# EAGLE design Projek (EAGLE 6.6.0)
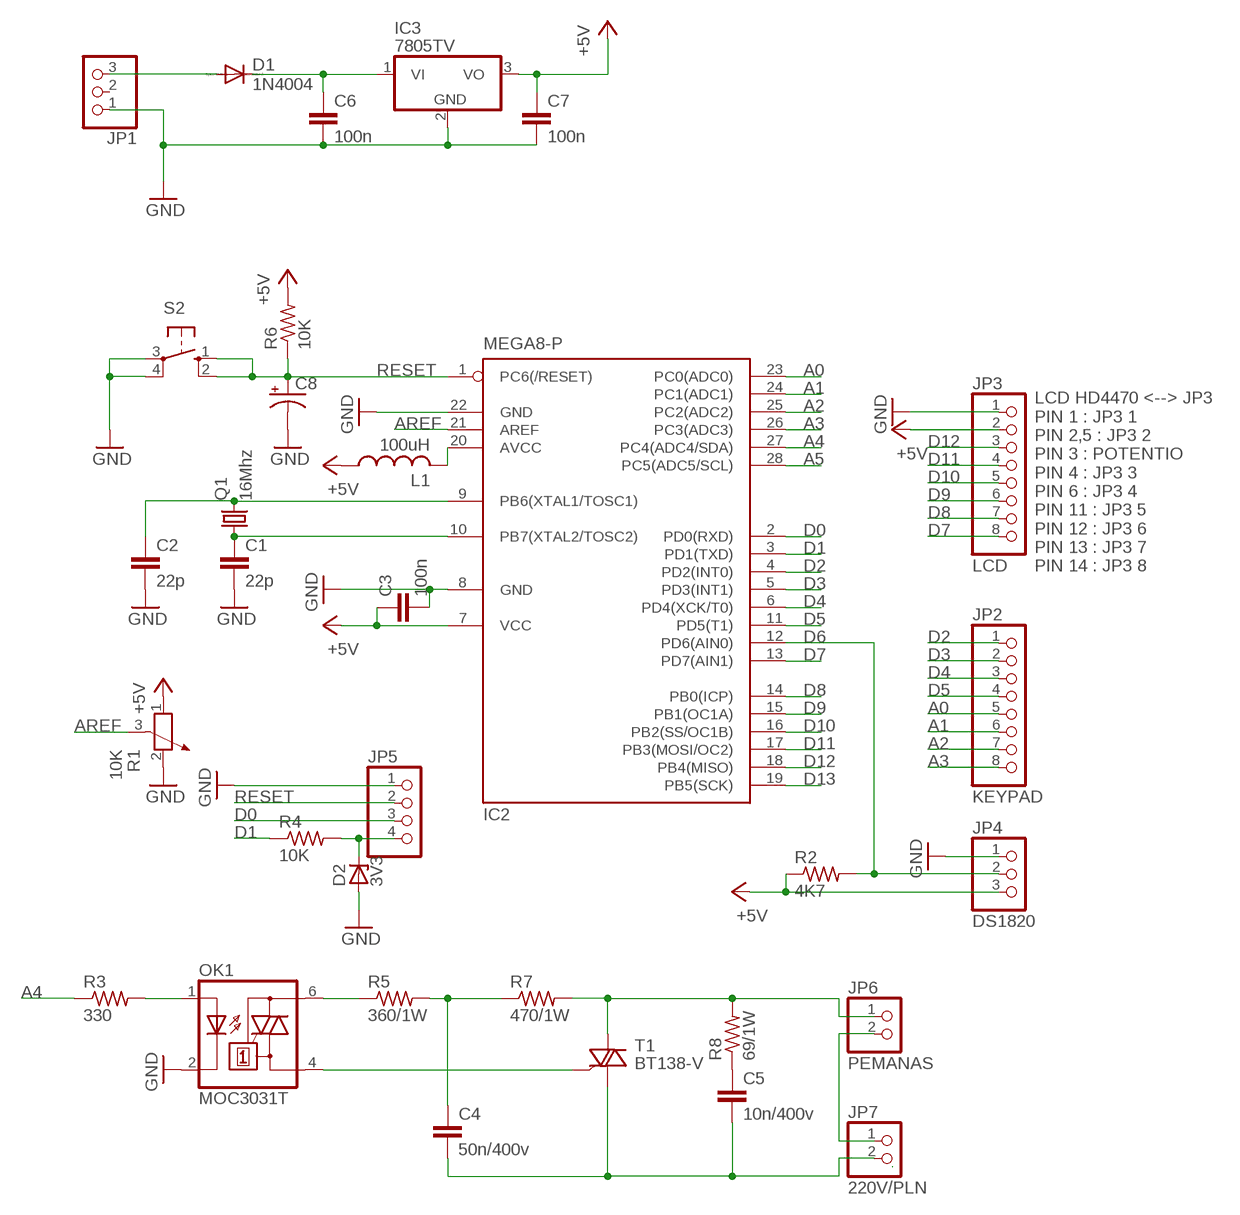
[diagram p0: schematic, sheet 1]

## Parts
C1  22p  C-EU025-025X050  [C025-025X050]
C2  22p  C-EU025-025X050  [C025-025X050]
C3  100n  C-EU050-025X075  [C050-025X075]
C4  50n/400v  C-EU150-064X183  [C150-064X183]
C5  10n/400v  C-EU150-064X183  [C150-064X183]
C6  100n  C-EU050-025X075  [C050-025X075]
C7  100n  C-EU050-025X075  [C050-025X075]
C8  CPOL-USE2-5  [E2-5]
D1  1N4004  [DO41-10]
D2  3V3  ZENER-DIODEDO35Z10  [DO35Z10]
IC2  MEGA8-P  [DIL28-3]
IC3  7805TV  [TO220V]
JP1  PINHD-1X3  [1X03]
JP2  KEYPAD  PINHD-1X8  [1X08]
JP3  LCD  PINHD-1X8  [1X08]
JP4  DS1820  PINHD-1X3  [1X03]
JP5  PINHD-1X4  [1X04]
JP6  PEMANAS  PINHD-1X2  [1X02]
JP7  220V/PLN  PINHD-1X2  [1X02]
L1  100uH  L-US0207/10  [0207/10]
OK1  MOC3031T  [DIL06B]
Q1  16Mhz  CRYSTALHC49U70  [HC49U70]
R1  10K  POTENTIOMETER_PT-10  [PT-10]
R2  4K7  R-US_0309/10  [0309/10]
R3  330  R-US_0309/10  [0309/10]
R4  10K  R-US_0309/10  [0309/10]
R5  360/1W  R-US_0414/15  [0414/15]
R6  10K  R-US_0309/10  [0309/10]
R7  470/1W  R-US_0414/15  [0414/15]
R8  69/1W  R-US_0414/15  [0414/15]
S2  10-XX  [B3F-10XX]
T1  BT138-V  [TO220BV]

## Nets
+5V [power]: C3.1 C7.1 IC2.7(VCC) IC3.3(VO) JP3.2 JP4.3 L1.1 R1.1 R2.1 R6.2
A0: IC2.23(PC0(ADC0)) JP2.5
A1: IC2.24(PC1(ADC1)) JP2.6
A2: IC2.25(PC2(ADC2)) JP2.7
A3: IC2.26(PC3(ADC3)) JP2.8
A4: IC2.27(PC4(ADC4/SDA)) R3.1
A5: IC2.28(PC5(ADC5/SCL))
AREF: IC2.21(AREF) R1.3
D0: IC2.2(PD0(RXD)) JP5.3
D1: IC2.3(PD1(TXD)) R4.1
D2: IC2.4(PD2(INT0)) JP2.1
D3: IC2.5(PD3(INT1)) JP2.2
D4: IC2.6(PD4(XCK/T0)) JP2.3
D5: IC2.11(PD5(T1)) JP2.4
D6: IC2.12(PD6(AIN0)) JP4.2 R2.2
D7: IC2.13(PD7(AIN1)) JP3.8
D8: IC2.14(PB0(ICP)) JP3.7
D9: IC2.15(PB1(OC1A)) JP3.6
D10: IC2.16(PB2(SS/OC1B)) JP3.5
D11: IC2.17(PB3(MOSI/OC2)) JP3.4
D12: IC2.18(PB4(MISO)) JP3.3
D13: IC2.19(PB5(SCK))
GND: C1.2 C2.2 C3.2 C6.2 C7.2 C8.- D2.A IC2.8(GND) IC2.22(GND) IC3.2(GND) JP1.1 JP3.1 JP4.1 JP5.1 OK1.2(C) R1.2 S2.3(P) S2.4(P1)
N$1: D1.A JP1.3
N$2: C2.1 IC2.9(PB6(XTAL1/TOSC1)) Q1.2
N$3: C1.1 IC2.10(PB7(XTAL2/TOSC2)) Q1.1
N$4: C6.1 D1.C IC3.1(VI)
N$5: IC2.20(AVCC) L1.2
N$6: OK1.1(A) R3.2
N$7: D2.C JP5.4 R4.2
N$8: OK1.4(A1) T1.G
N$9: JP6.1 R7.2 R8.2 T1.T2(A2)
N$10: OK1.6(A2) R5.1
N$11: C4.1 R5.2 R7.1
N$12: C4.2 C5.2 JP7.2 T1.T1(A1)
N$13: C5.1 R8.1
N$15: JP6.2 JP7.1
RESET: C8.+ IC2.1(PC6(/RESET)) JP5.2 R6.1 S2.1(S) S2.2(S1)
Unconnected: JP1.2

## Notes on the sheet
- LCD HD4470 <--> JP3
  PIN 1 : JP3 1
  PIN 2,5 : JP3 2
  PIN 3 : POTENTIO
  PIN 4 : JP3 3 
  PIN 6 : JP3 4
  PIN 11 : JP3 5
  PIN 12 : JP3 6
  PIN 13 : JP3 7
  PIN 14 : JP3 8

## Library data of the parts
C1-C7 = rcl:C-EU: CAPACITOR, European symbol
C8 = rcl:CPOL-US: POLARIZED CAPACITOR, American symbol
D1 = diode:1N4004: DIODE general purpose rectifier, 1 A
D2 = diode:ZENER-DIODE: Z-Diode
IC2 = atmel:MEGA8-P: MICROCONTROLLER 8 Kbytes FLASH, 1 kbytes SRAM, 512 bytes EEPROM, USART, 4-channel 10 bit ADC, 2-channel 8 bit ADC Pin compatible with Atmega48, ATMega88, ATMega168 Source: avr.lbr; OC_FARNELL: unknown; OC_NEWARK: unknown
IC3 = linear:78*: Positive VOLTAGE REGULATOR Source: http://cache.national.com/ds/LM/LM78L05.pdf http://www.fairchildsemi.com/ds/LM/LM7805.pdf
JP1 JP4 = pinhead:PINHD-1X3: PIN HEADER
JP2 JP3 = pinhead:PINHD-1X8: PIN HEADER
JP5 = pinhead:PINHD-1X4: PIN HEADER
JP6 JP7 = pinhead:PINHD-1X2: PIN HEADER
L1 = rcl:L-US: INDUCTOR, American symbol
OK1 = optocoupler:MOC30*: 6-Pin DIP Zero-Cross Optoisolators Triac Driver Output (250/400 Volt Peak) Source: Data sheet <http://www.fairchildsemi.com/ds/MO/MOC3031M.pdf> The old path of data sheet not more available 2013-05-06.; OC_FARNELL: unknown; OC_NEWARK: unknown
Q1 = crystal:CRYSTAL: CRYSTAL; OC_FARNELL: unknown; OC_NEWARK: unknown
R1 = rcl:POTENTIOMETER_: Potentiometer
R2-R8 = rcl:R-US_: RESISTOR, American symbol
S2 = switch-omron:10-XX: OMRON SWITCH; MPN: B3F-1000; OC_FARNELL: 176432; OC_NEWARK: 36M3542
T1 = triac:BT138: TRIAC Source: http://www.semiconductors.philips.com BT138_SERIES_2.pdf

## Net classes
1 power: width 0.61 mm

## Board
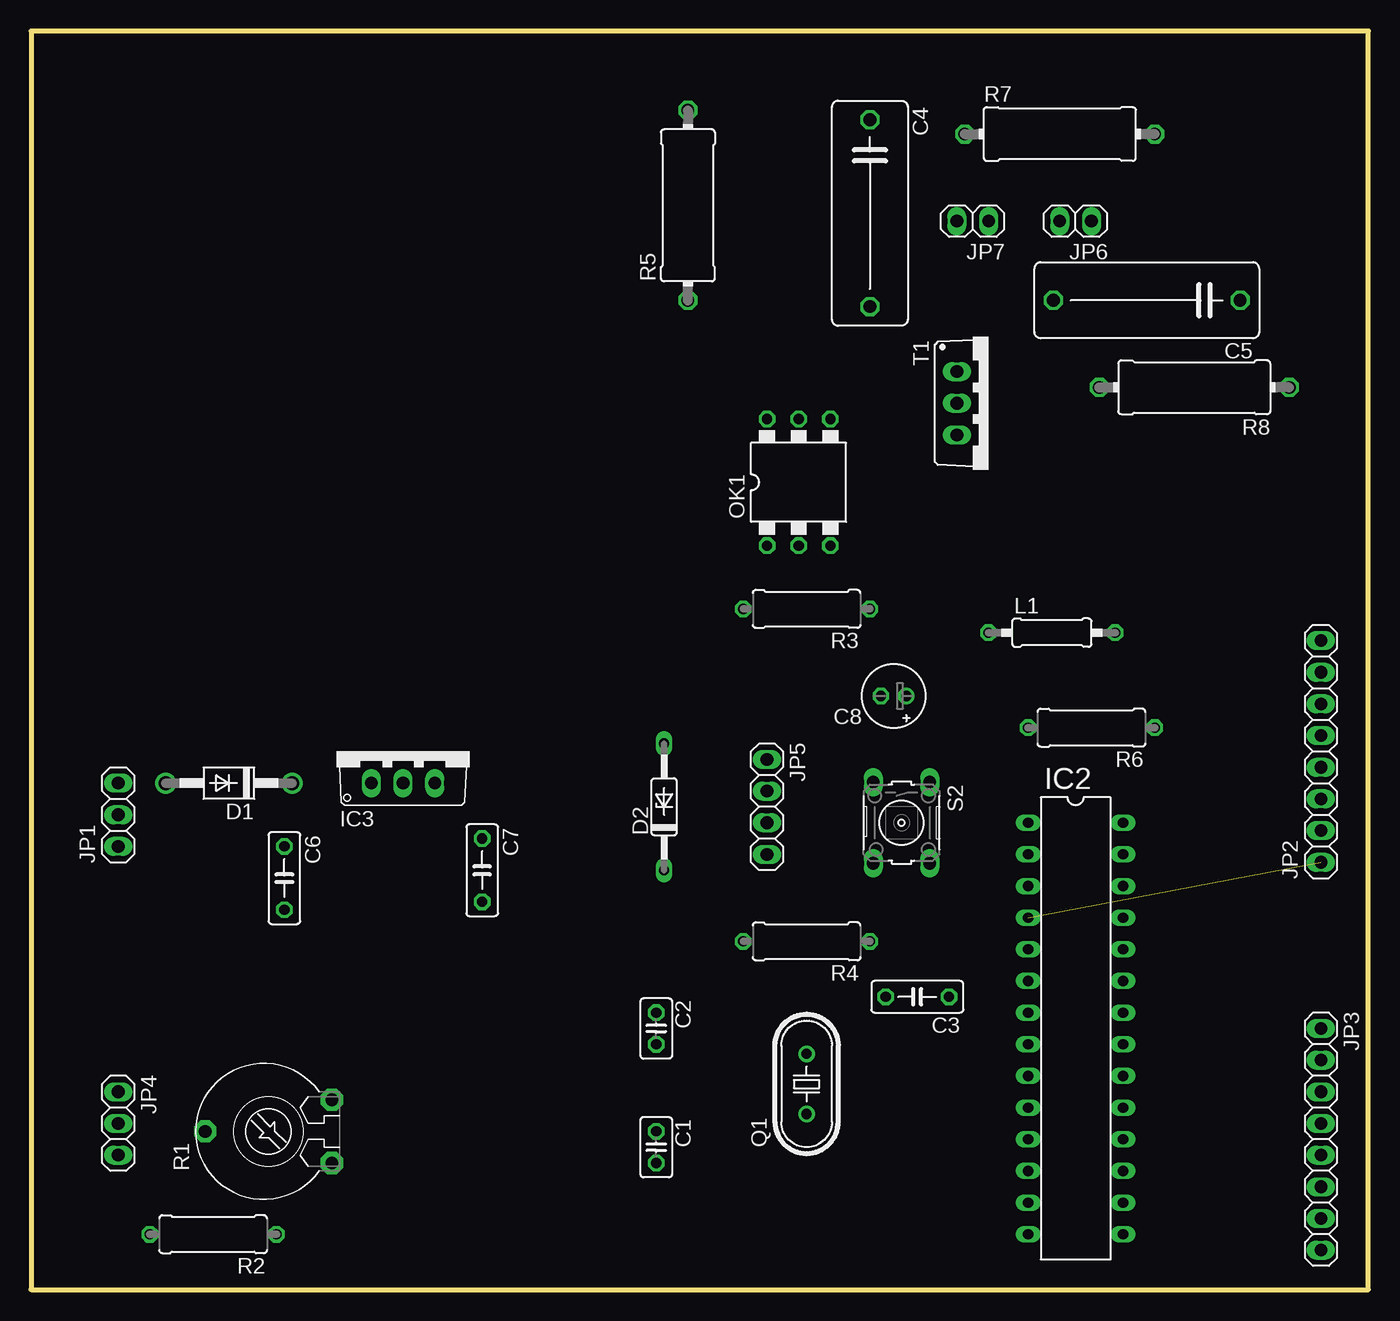
[diagram p1: board, top side]
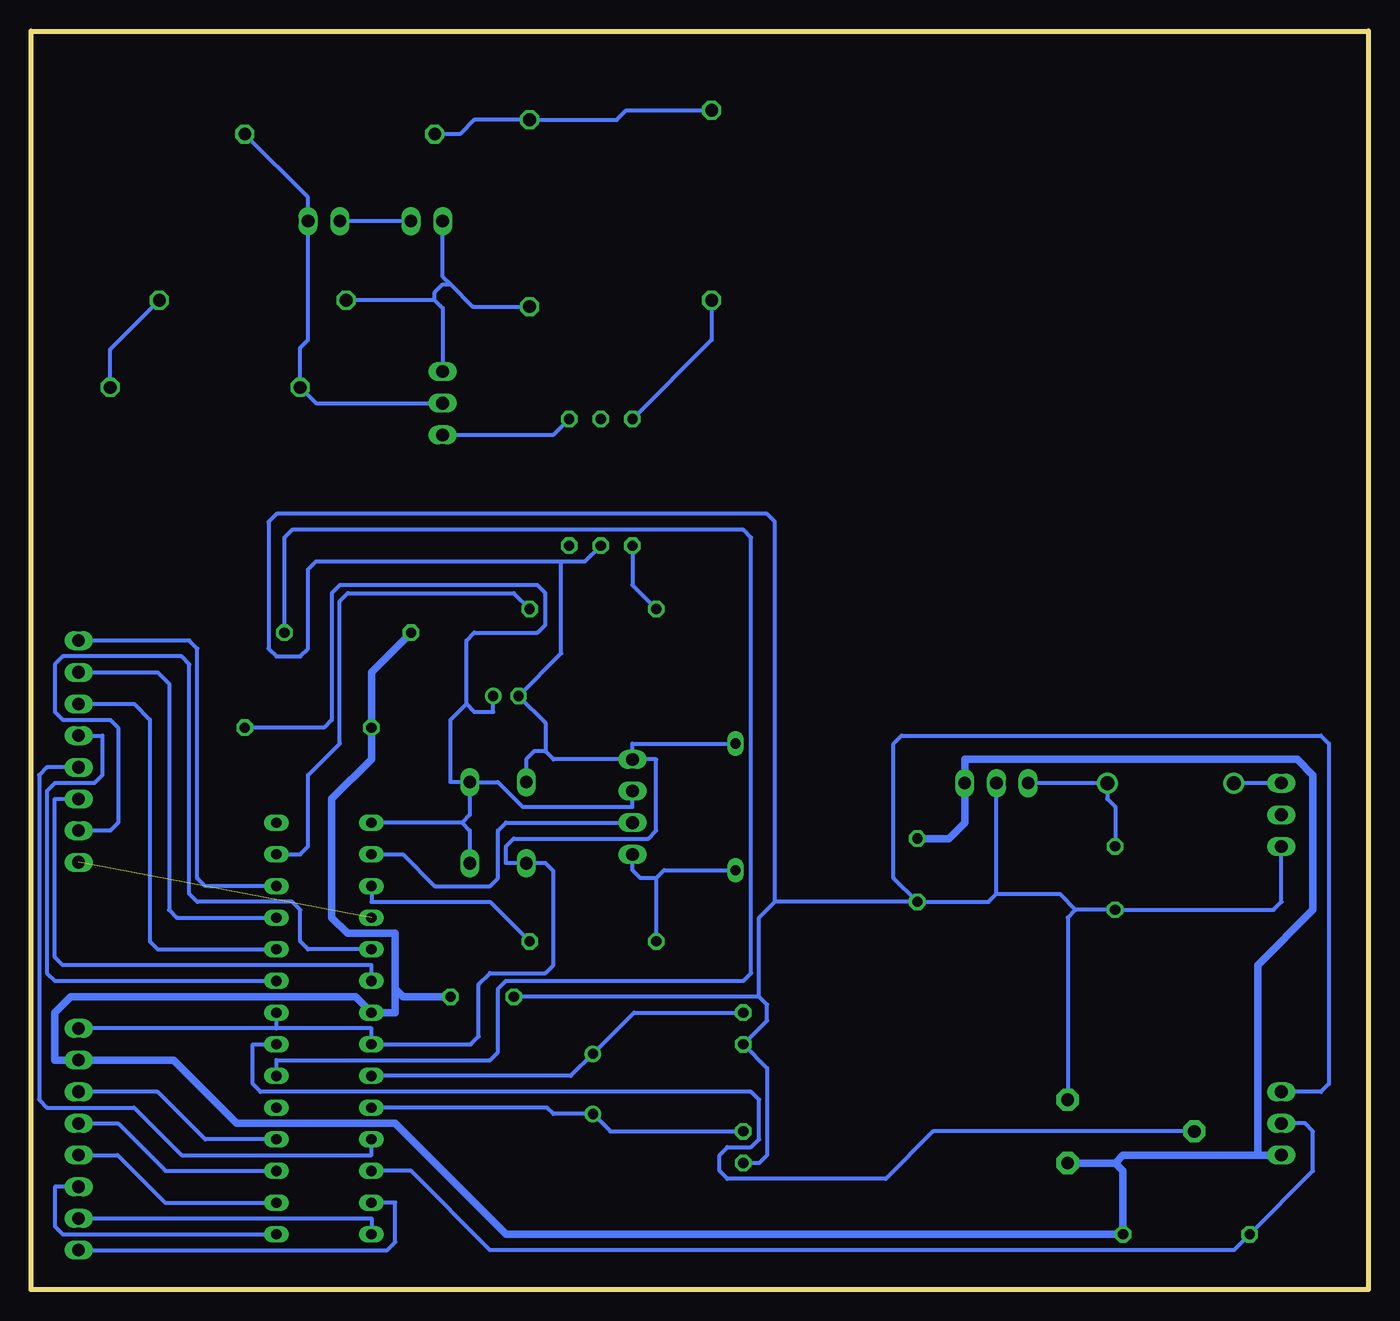
[diagram p2: board, bottom side, seen from below]

Size 107.31 x 100.96 mm. Coordinates in mm from the lower left corner, seen from the top.
Outline: 0,0 107.31,0 107.31,100.96 0,100.96 0,0
Copper layers (1*16): Top 0.035mm / dielectric 1.5mm / Bottom 0.035mm
Design rules "gizmo": minimum track width 0.6mm, minimum drill 0.6mm, track to track 0.67mm, track to pad 0.67mm, pad to pad 0.67mm, via to via 0.67mm, smd to smd 0mil, copper to edge 0mil, drill to drill 8mil, minimum pad ring 10mil, minimum via ring 8mil, stop-mask expansion 0mil, vias tented up to drill 0mil, thermal gap 10mil
bRestrict: 6 lines

### Footprints (pad centres in the part's own frame; a part is rotated, then mirrored left to right if it is on the bottom)
C025-025X050 = drill 0.813 octagon: 1 -1.27,0; 2 1.27,0
C050-025X075 = drill 0.813 octagon: 1 -2.54,0; 2 2.54,0
C150-064X183 = drill 1.016 octagon: 1 -7.493,0; 2 7.493,0
E2-5 = drill 0.813 pad 1.27: + -1.016,0 | drill 0.813 pad 1.27 octagon: - 1.016,0
DO41-10 = drill 1.118: A 5.08,0; C -5.08,0
DO35Z10 = drill 0.813 long: A 5.08,0; C -5.08,0
DIL28-3 = drill 0.813 long: 1 -16.51,-3.81; 2 -13.97,-3.81; 3 -11.43,-3.81; 4 -8.89,-3.81; 5 -6.35,-3.81; 6 -3.81,-3.81; 7 -1.27,-3.81; 8 1.27,-3.81; 9 3.81,-3.81; 10 6.35,-3.81; 11 8.89,-3.81; 12 11.43,-3.81; 13 13.97,-3.81; 14 16.51,-3.81; 15 16.51,3.81; 16 13.97,3.81; 17 11.43,3.81; 18 8.89,3.81; 19 6.35,3.81; 20 3.81,3.81; 21 1.27,3.81; 22 -1.27,3.81; 23 -3.81,3.81; 24 -6.35,3.81; 25 -8.89,3.81; 26 -11.43,3.81; 27 -13.97,3.81; 28 -16.51,3.81
TO220V = drill 1.016 long: 1 -2.54,-2.54; 2 0,-2.54; 3 2.54,-2.54
1X03 = drill 1.016 long: 1 -2.54,0; 2 0,0; 3 2.54,0
1X08 = drill 1.016 long: 1 -8.89,0; 2 -6.35,0; 3 -3.81,0; 4 -1.27,0; 5 1.27,0; 6 3.81,0; 7 6.35,0; 8 8.89,0
1X04 = drill 1.016 long: 1 -3.81,0; 2 -1.27,0; 3 1.27,0; 4 3.81,0
1X02 = drill 1.016 long: 1 -1.27,0; 2 1.27,0
0207/10 = drill 0.813 octagon: 1 -5.08,0; 2 5.08,0
DIL06B = drill 0.813 octagon: 1 -2.54,-5.08; 2 0,-5.08; 3 2.54,-5.08; 4 2.54,5.08; 5 0,5.08; 6 -2.54,5.08
HC49U70 = drill 0.813: 1 -2.413,0; 2 2.413,0
PT-10 = drill 1.016 pad 1.778 octagon: 1 -2.54,-5.08; 2 2.54,-5.08; 3 0,5.08
0309/10 = drill 0.813 octagon: 1 -5.08,0; 2 5.08,0
0414/15 = drill 1.016 octagon: 1 -7.62,0; 2 7.62,0
B3F-10XX = drill 1.016 long: 1 -3.251,2.261; 2 3.251,2.261; 3 -3.251,-2.261; 4 3.251,-2.261
TO220BV = drill 1.016 long: G 2.54,-2.54; T1 -2.54,-2.54; T2 0,-2.54

### Placement (x,y rotation side)
C1  50.16,11.43 270 top
C2  50.16,20.95 270 top
C3  71.12,23.5 180 top
C4  67.31,86.36 270 top
C5  89.53,79.38 180 top
C6  20.32,33.02 270 top
C7  36.2,33.66 270 top
C8  69.22,47.62 180 top
D1  15.88,40.64 180 top
D2  50.8,38.74 90 top
IC2  83.82,20.95 270 top
IC3  29.84,43.18 0 top
JP1  6.99,38.1 90 top
JP2  103.5,43.18 90 top
JP3  103.5,12.06 270 top
JP4  6.99,13.33 270 top
JP5  59.05,38.74 270 top
JP6  83.82,85.72 180 top
JP7  75.56,85.72 180 top
L1  81.92,52.71 0 top
OK1  61.59,64.77 0 top
Q1  62.23,16.51 90 top
R1  19.05,12.7 90 top
R2  14.61,4.45 180 top
R3  62.23,54.61 180 top
R4  62.23,27.94 180 top
R5  52.7,86.99 90 top
R6  85.09,45.09 180 top
R7  82.55,92.71 0 top
R8  93.34,72.39 180 top
S2  69.85,37.47 270 top
T1  76.83,71.12 270 top

### Tracks (layer width: path | path; a pad name or v marks a point on that pad's centre or on a via)
+5V
  Bottom 0.61: 8.89,10.79 8.89,26.04 4.45,30.48 4.45,41.28 5.71,42.55 32.38,42.55 IC3.3 32.38,37.47 33.66,36.2 C7.1 | 20.32,10.16 19.68,10.79 8.89,10.79 | 8.89,10.79 JP4.3 | 78.11,24.13 78.11,28.57 81.92,28.57 83.19,29.84 83.19,39.37 80.01,42.55 R6.2 80.01,49.53 L1.1 | 20.32,10.16 19.68,9.53 R2.1 69.22,4.45 78.11,13.33 90.81,13.33 95.89,18.41 JP3.2 105.41,18.41 105.41,22.22 104.14,23.5 81.28,23.5 IC2.7 78.11,22.22 78.11,24.13 | 78.11,24.13 77.47,23.5 C3.1 | 20.32,10.16 R1.1
A0
  Bottom 0.305: JP2.5 101.6,44.45 101.6,41.28 102.23,40.64 105.41,40.64 106.05,40.01 106.05,25.4 105.41,24.77 IC2.23
A1
  Bottom 0.305: JP2.6 99.06,46.99 97.79,45.72 97.79,27.94 97.16,27.3 IC2.24
A2
  Bottom 0.305: JP2.7 97.16,49.53 96.25,48.63 96.25,30.48 95.62,29.84 IC2.25
A3
  Bottom 0.305: IC2.26 93.34,32.38 93.98,33.02 93.98,51.44 94.61,52.07 JP2.8
A4
  Bottom 0.305: IC2.27 85.72,34.93 85.09,35.56 85.09,41.28 82.55,43.82 82.55,55.25 81.92,55.88 68.58,55.88 R3.1
AREF
  Bottom 0.305: R1.3 34.92,12.7 38.73,8.89 51.44,8.89 52.07,9.53 52.07,10.79 51.44,11.43 49.53,11.43 48.9,12.06 48.9,15.24 49.53,15.88 88.9,15.88 89.53,16.51 89.53,19.68 IC2.21
D0
  Bottom 0.305: IC2.2 77.47,34.93 74.93,32.38 70.48,32.38 69.85,33.02 69.85,36.83 69.22,37.47 JP5.3
D1
  Bottom 0.305: IC2.3 80.01,31.11 70.48,31.11 R4.1
D2  (1 unrouted)
D3
  Bottom 0.305: IC2.5 85.09,27.3 85.72,27.94 85.72,30.48 86.36,31.11 93.98,31.11 94.61,31.75 94.61,50.17 95.25,50.8 104.78,50.8 105.41,50.17 105.41,46.36 104.78,45.72 100.97,45.72 100.33,45.09 100.33,37.47 100.97,36.83 JP2.2
D4
  Bottom 0.305: IC2.6 80.01,26.04 104.78,26.04 105.41,26.67 105.41,39.37 JP2.3
D5
  Bottom 0.305: JP2.4 106.05,41.91 106.68,41.28 106.68,15.24 106.05,14.61 99.06,14.61 95.25,10.79 80.01,10.79 IC2.11
D6
  Bottom 0.305: IC2.12 76.83,9.53 70.48,3.17 10.79,3.17 R2.2 4.45,9.53 4.45,12.7 5.08,13.33 JP4.2
D7
  Bottom 0.305: JP3.8 78.74,3.17 78.11,3.81 78.11,6.98 IC2.13
D8
  Bottom 0.305: JP3.7 80.01,5.71 IC2.14
D9
  Bottom 0.305: JP3.6 105.41,8.26 105.41,5.08 104.78,4.45 IC2.15
D10
  Bottom 0.305: JP3.5 100.37,10.79 96.56,6.98 IC2.16
D11
  Bottom 0.305: JP3.4 100.33,13.33 96.52,9.53 IC2.17
D12
  Bottom 0.305: IC2.18 93.34,12.06 97.16,15.88 JP3.3
GND
  Bottom 0.305: 87.63,20.95 80.01,20.95 IC2.8 72.03,19.68 71.39,20.32 71.39,24.49 70.48,25.4 66.04,25.4 65.41,26.04 65.41,33.58 66.04,34.21 S2.4 69.22,34.21 69.22,35.56 68.58,36.2 57.78,36.2 57.15,36.83 57.15,42.55 JP5.1 | 87.63,20.95 JP3.1 | 47.62,31.11 47.62,61.6 48.26,62.23 87.63,62.23 88.27,61.6 88.27,51.44 87.63,50.8 85.72,50.8 85.09,51.44 85.09,57.79 84.45,58.42 64.77,58.42 | C7.2 38.1,33.02 38.1,43.82 37.47,44.45 3.81,44.45 3.17,43.82 3.17,16.51 3.81,15.88 JP4.1 | JP1.1 6.99,31.11 7.62,30.48 C6.2 23.5,30.48 | C1.2 48.9,10.16 48.26,10.79 48.26,17.78 C2.2 48.26,21.59 48.26,22.86 48.9,23.5 | 87.63,20.95 IC2.22 | JP5.1 59.05,43.82 D2.A | 29.84,31.75 24.77,31.75 23.5,30.48 | 23.5,30.48 24.13,29.84 R1.2 | 64.77,58.42 64.77,51.05 C8.- 66.04,45.47 66.04,43.18 | 64.77,58.42 62.87,58.42 OK1.2 | 66.04,43.18 66.95,43.18 67.59,42.55 S2.3 | 48.9,23.5 C3.2 | 29.84,31.75 IC3.2 | 48.9,23.5 48.9,29.84 47.62,31.11 | JP5.1 65.41,42.55 66.04,43.18 | C7.2 30.48,31.11 29.84,31.75 | C7.2 47.62,31.11
N$1
  Bottom 0.305: JP1.3 D1.A
N$2
  Bottom 0.305: C2.1 58.93,22.22 Q1.2 64.01,17.14 IC2.9
N$3
  Bottom 0.305: C1.1 60.83,12.7 Q1.1 65.41,14.1 65.91,14.61 IC2.10
N$4
  Bottom 0.305: C6.1 20.32,38.74 20.95,39.37 D1.C IC3.1
N$5
  Bottom 0.305: IC2.20 87.63,18.41 70.48,18.41 69.85,19.05 69.85,24.13 69.22,24.77 50.16,24.77 49.53,25.4 49.53,60.33 50.16,60.96 86.36,60.96 87,60.33 L1.2
N$6
  Bottom 0.305: OK1.1 59.05,56.52 R3.2
N$7
  Bottom 0.305: 57.15,33.02 58.42,33.02 59.05,33.66 JP5.4 | 57.15,33.02 56.52,33.66 D2.C | 57.15,33.02 R4.2
N$8
  Bottom 0.305: T1.G 65.41,68.58 OK1.4
N$9
  Bottom 0.305: R7.2 85.09,87.63 JP6.1 85.09,76.2 85.72,75.56 R8.2 84.45,71.12 T1.T2
N$10
  Bottom 0.305: R5.1 52.7,76.2 OK1.6
N$11
  Bottom 0.305: R5.2 59.56,94.61 60.33,93.85 C4.1 71.75,93.85 72.9,92.71 R7.1
N$12
  Bottom 0.305: 73.66,80.64 74.3,81.28 JP7.2 | 73.66,80.64 71.88,78.87 C4.2 | 74.93,79.38 C5.2 | 74.93,79.38 74.3,78.74 T1.T1 | 74.93,79.38 74.93,80.01 74.3,80.64 73.66,80.64
N$13
  Bottom 0.305: R8.1 100.97,75.44 C5.1
N$15
  Bottom 0.305: JP7.1 JP6.2
RESET
  Bottom 0.305: S2.1 69.85,40.72 67.87,38.74 59.05,38.74 JP5.2 | S2.1 73.66,40.72 73.66,45.72 72.39,46.99 | 72.39,46.99 71.75,46.36 70.23,46.36 C8.+ | 72.75,37.47 IC2.1 | 72.75,37.47 72.11,36.83 S2.2 | S2.1 72.11,38.1 72.75,37.47 | 72.39,46.99 72.39,52.07 71.75,52.71 66.67,52.71 66.04,53.34 66.04,55.88 66.67,56.52 82.55,56.52 83.19,55.88 83.19,45.72 83.82,45.09 R6.1

### Text on the board
bRestrict: Arduino | R.2 | V.3 | S3 | Pin0/1 | 2008 | REF | GND | SERIAL | ON | www.arduino.cc | AKASHI | A. | BANZI | M. | AUTO | CUARTIELLES | D. | CC BY SA 2.5 | RESET | ENABLE | MARTINO | G. | IGOE | T. | ZAMBETTI | N. | MELLIS | D.
tCredits: ADILSON AKASHI | MASSIMO BANZI | DAVID CUARTIELLES | TOM IGOE | GIANLUCA MARTINO | DAVID A. MELLIS | NICHOLAS ZAMBETTI | Released under the Creative Commons Attribution Share-Alike 2.5 License | http://creativecommons.org/licenses/by-sa/2.5/